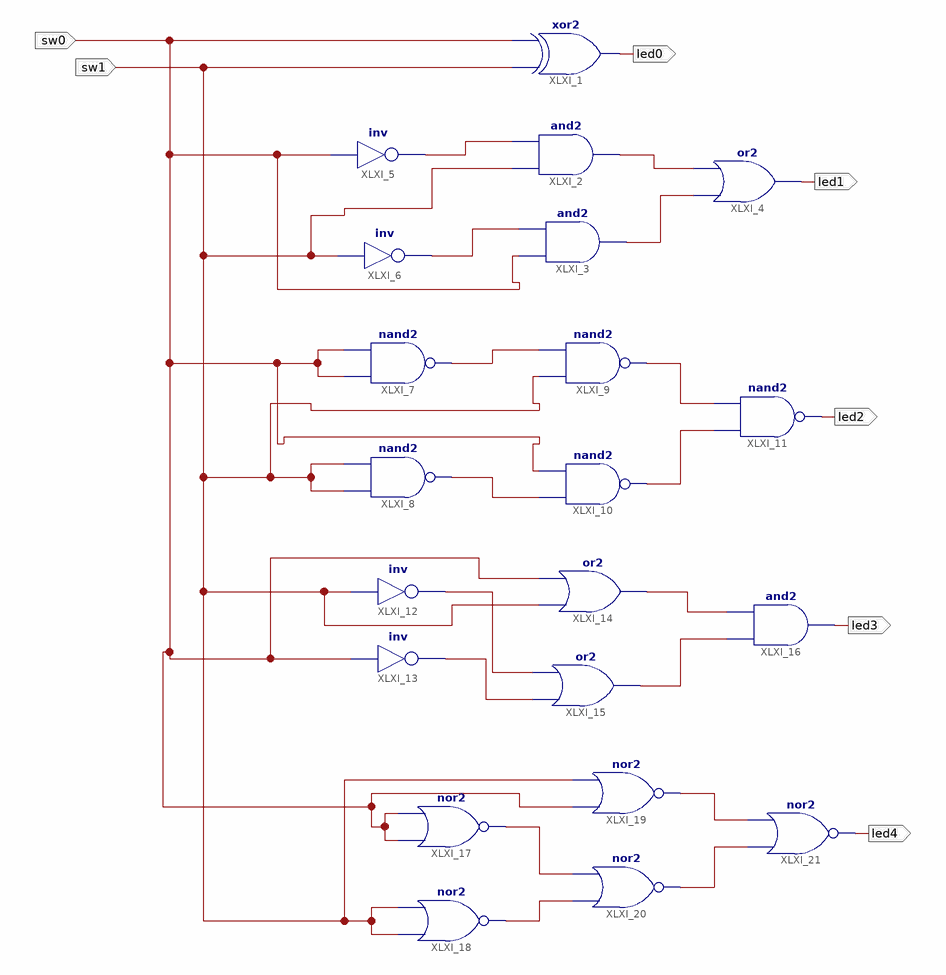
[diagram p0: schematic sheet 1]
// Xilinx ISE schematic Lab41.sch (artix7) as structural Verilog: 21 symbols, 7 ports
module Lab41 (
  input  sw0,
  input  sw1,
  output led0,
  output led1,
  output led2,
  output led3,
  output led4
);

  wire XLXN_5, XLXN_6, XLXN_7, XLXN_8, XLXN_13, XLXN_14, XLXN_16, XLXN_17, XLXN_23, XLXN_24, XLXN_26,
       XLXN_27, XLXN_30, XLXN_31, XLXN_33, XLXN_34;

  xor XLXI_1 (led0, sw1, sw0);
  and XLXI_2 (XLXN_5, sw1, XLXN_8);
  and XLXI_3 (XLXN_6, sw0, XLXN_7);
  or XLXI_4 (led1, XLXN_6, XLXN_5);
  not XLXI_5 (XLXN_8, sw0);
  not XLXI_6 (XLXN_7, sw1);
  nand XLXI_7 (XLXN_16, sw0, sw0);
  nand XLXI_8 (XLXN_17, sw1, sw1);
  nand XLXI_9 (XLXN_13, sw1, XLXN_16);
  nand XLXI_10 (XLXN_14, XLXN_17, sw0);
  nand XLXI_11 (led2, XLXN_14, XLXN_13);
  not XLXI_12 (XLXN_27, sw1);
  not XLXI_13 (XLXN_26, sw0);
  or XLXI_14 (XLXN_23, sw1, sw0);
  or XLXI_15 (XLXN_24, XLXN_26, XLXN_27);
  and XLXI_16 (led3, XLXN_24, XLXN_23);
  nor XLXI_17 (XLXN_33, sw0, sw0);
  nor XLXI_18 (XLXN_34, sw1, sw1);
  nor XLXI_19 (XLXN_30, sw0, sw1);
  nor XLXI_20 (XLXN_31, XLXN_34, XLXN_33);
  nor XLXI_21 (led4, XLXN_31, XLXN_30);
endmodule
